# EAGLE schematic iSkipper.Ver.1.0.1 (EAGLE 9.0.0)
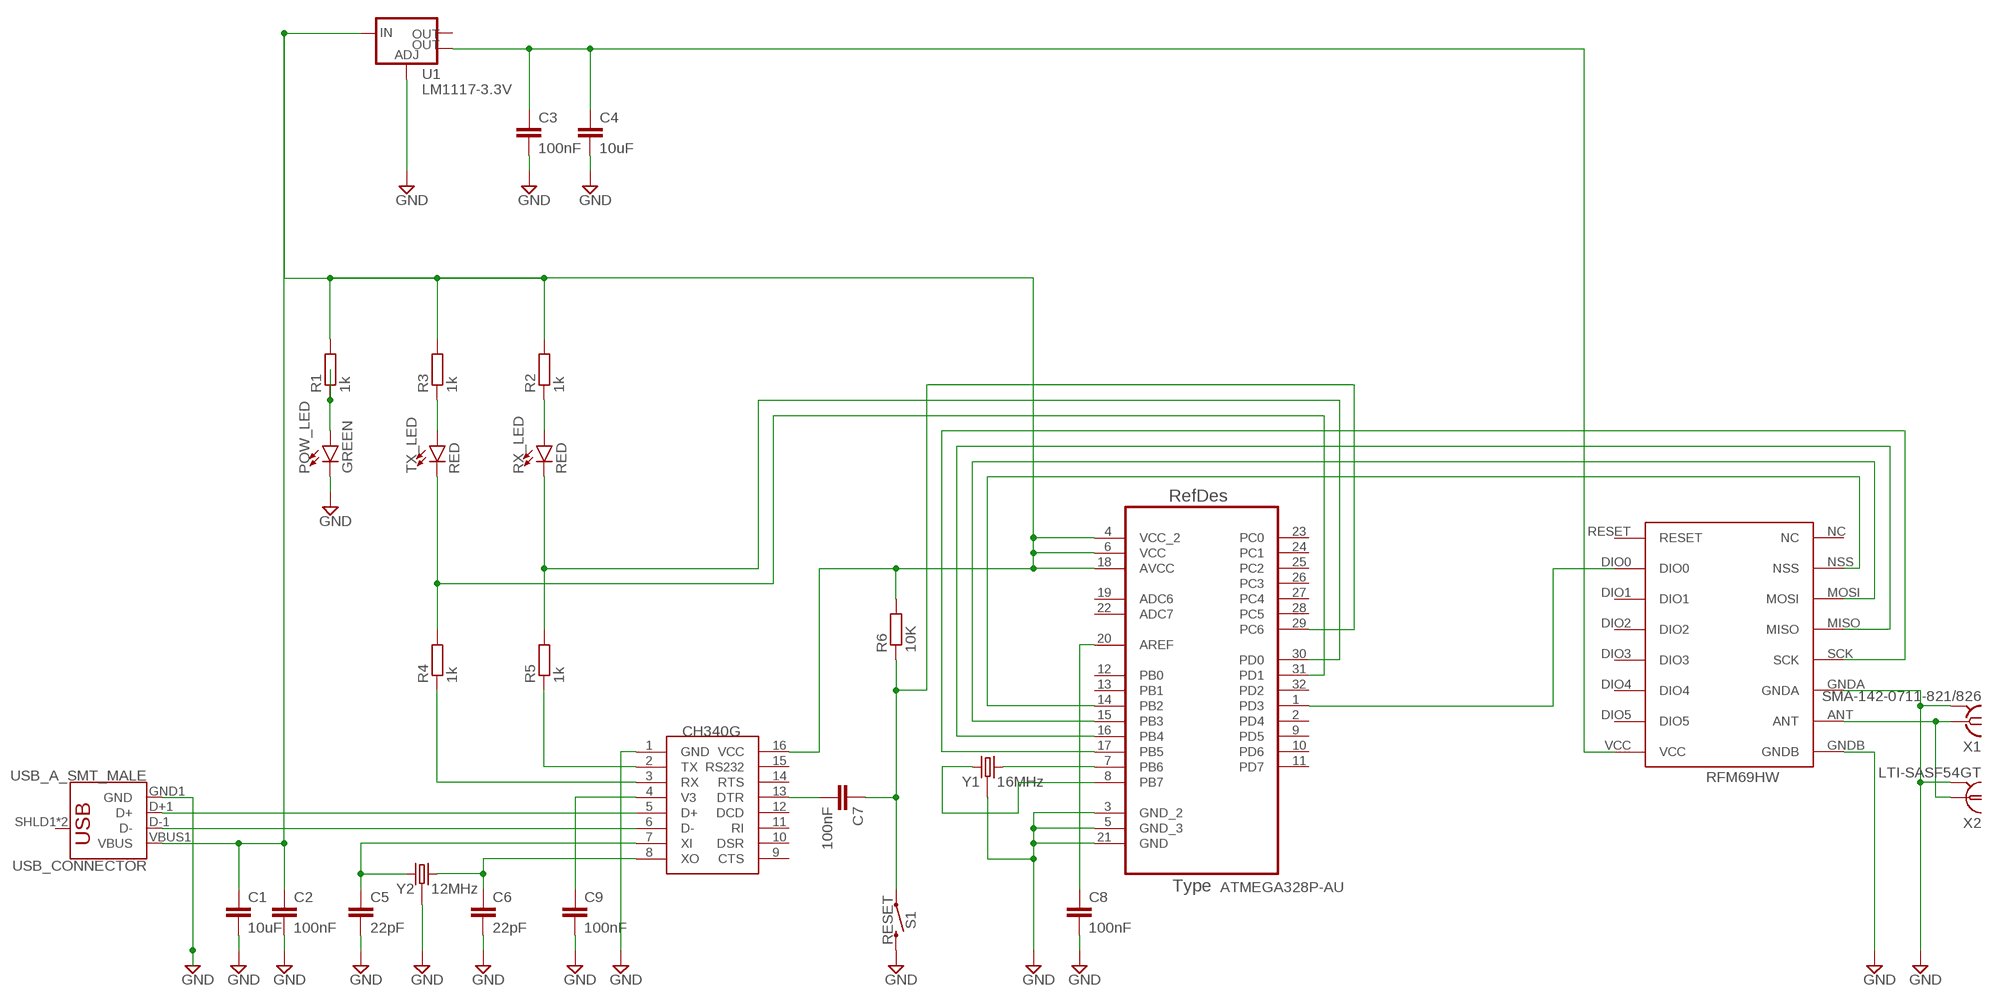
[diagram p0: schematic, sheet 1]

## Parts
ATMEGA328P  ATMEGA328P-AU  [QFP80P900X900X120-32N]
C1  10uF  CC1206  [C1206]
C2  100nF  CC1206  [C1206]
C3  100nF  C-EUC1206  [C1206]
C4  10uF  CC1206  [C1206]
C5  22pF  C-EUC1206  [C1206]
C6  22pF  C-EUC1206  [C1206]
C7  100nF  C-EUC1206  [C1206]
C8  100nF  C-EUC1206  [C1206]
C9  100nF  CC1206  [C1206]
POW_LED  GREEN  LED-GREEN1206  [LED-1206]
R1  1k  RR1206  [R1206]
R2  1k  RR1206  [R1206]
R3  1k  RR1206  [R1206]
R4  1k  RR1206  [R1206]
R5  1k  RR1206  [R1206]
R6  10K  RR1206  [R1206]
RFM69HW  RFM69HW  [RFM]
RX_LED  RED  LED-RED1206  [LED-1206]
S1  RESET  MOMENTARY-SWITCH-SPST-SMD-5.2MM  [TACTILE_SWITCH_SMD_5.2MM]
TX_LED  RED  LED-RED1206  [LED-1206]
U1  LM1117-3.3V  V_REG_LM1117SOT223  [SOT223]
U$1  CH340G  [SOIC16]
USB_CONNECTOR  USB_A_SMT_MALE  [USB-A-SMT-MALE]
X1  SMA-142-0711-821/826  [J502-ND-142-0711-821/826]
X2  LTI-SASF54GT  [LTI-SASF54GT]
Y1  16MHz  CRYSTAL-GROUNDEDSMD-3.2X2.5  [CRYSTAL-SMD-3.2X2.5MM]
Y2  12MHz  CRYSTAL-GROUNDEDSMD-3.2X2.5  [CRYSTAL-SMD-3.2X2.5MM]

## Nets
GND [Ground]: ATMEGA328P.3(GND_2) ATMEGA328P.5(GND_3) ATMEGA328P.21(GND) C1.2 C2.2 C3.2 C4.2 C5.2 C6.2 C8.2 C9.2 POW_LED.C RFM69HW.GNDA RFM69HW.GNDB S1.3 U1.1(ADJ) U$1.1(GND) USB_CONNECTOR.GND1(GND) X1.G@1 X1.G@2 X1.G@3 X1.G@4 X2.2 X2.3 X2.4 X2.5 Y1.2 Y1.4 Y2.2 Y2.4
N$1: ATMEGA328P.7(PB6) Y1.3
N$2: ATMEGA328P.8(PB7) Y1.1
N$3 [+5.0V]: ATMEGA328P.4(VCC_2) ATMEGA328P.6(VCC) ATMEGA328P.18(AVCC) C1.1 C2.1 R1.2 R2.2 R3.2 R6.2 U1.3(IN) U$1.16(VCC) USB_CONNECTOR.VBUS1(VBUS)
N$4: ATMEGA328P.20(AREF) C8.1
N$5: U$1.5(D+) USB_CONNECTOR.D+1(D+)
N$6 [+3.3V]: C3.1 C4.1 RFM69HW.VCC U1.4(OUT)
N$7: POW_LED.A R1.1
N$8: R3.1 TX_LED.A
N$9: U$1.6(D-) USB_CONNECTOR.D-1(D-)
N$10: R2.1 RX_LED.A
N$11: R5.1 U$1.2(TX)
N$12: C6.1 U$1.8(XO) Y2.3
N$13: C5.1 U$1.7(XI) Y2.1
N$14: R4.1 U$1.3(RX)
N$15: ATMEGA328P.31(PD1) R4.2 TX_LED.C
N$16: ATMEGA328P.30(PD0) R5.2 RX_LED.C
N$17: C7.2 U$1.13(DTR)
N$18: ATMEGA328P.29(PC6) C7.1 R6.1 S1.1
N$19: RFM69HW.ANT X1.1 X2.1
N$20: C9.1 U$1.4(V3)
N$22: ATMEGA328P.17(PB5) RFM69HW.SCK
N$23: ATMEGA328P.1(PD3) RFM69HW.DIO0
N$24: ATMEGA328P.14(PB2) RFM69HW.NSS
N$25: ATMEGA328P.16(PB4) RFM69HW.MISO
N$26: ATMEGA328P.15(PB3) RFM69HW.MOSI
Unconnected: ATMEGA328P.2(PD4) ATMEGA328P.9(PD5) ATMEGA328P.10(PD6) ATMEGA328P.11(PD7) ATMEGA328P.12(PB0) ATMEGA328P.13(PB1) ATMEGA328P.19(ADC6) ATMEGA328P.22(ADC7) ATMEGA328P.23(PC0) ATMEGA328P.24(PC1) ATMEGA328P.25(PC2) ATMEGA328P.26(PC3) ATMEGA328P.27(PC4) ATMEGA328P.28(PC5) ATMEGA328P.32(PD2) RFM69HW.DIO1 RFM69HW.DIO2 RFM69HW.DIO3 RFM69HW.DIO4 RFM69HW.DIO5 RFM69HW.NC RFM69HW.RESET U1.2(OUT) U$1.9(CTS) U$1.10(DSR) U$1.11(RI) U$1.12(DCD) U$1.14(RTS) U$1.15(RS232) USB_CONNECTOR.SHLD1(SHIELD) USB_CONNECTOR.SHLD2(SHIELD)

## Library data of the parts
ATMEGA328P = Atmel-ATMEGA328P-AU:ATMEGA328P-AU; DESCRIPTION: 8-bit Microcontroller with In-System Programmable Flash; MPN: ATMEGA328P-AU; OC_FARNELL: 1715486; OC_NEWARK: 14R4631; PACKAGE: TQFP-32; SUPPLIER: Atmel
C1 C2 C4 C9 = eagle-ltspice:C: CAPACITOR, European symbol; SPICEMODEL: NONE; SPICEPREFIX: C
C3 C7 = rcl:C-EU: CAPACITOR, European symbol; SPICEPREFIX: C
C5 C6 C8 = resistor:C-EU: CAPACITOR, European symbol
POW_LED = SparkFun-LED:LED-GREEN: Green SMD LED Used in manufacturing of various products at SparkFun Packages: 0603 - SMD 0603 package [Product Link] <http://www.futureelectronics.com/en/technologies/semiconductors/optoelectronics/leds/Pages/9894312-LTST-C190GKT.aspx?CrossPart=HSMG-C190&IM=0> LilyPad 1206 - SMD1206 LilyPad package [Product Link] <http://www.futureelectronics.com/en/Technologies/Product.aspx?ProductID=IN150NGHARVATEKCORPORATION2049943&IM=0> 1206 - SMD1206 package [Product Link] <http://www.futureelectronics.com/en/technologies/semiconductors/optoelectronics/leds/Pages/8315665-LTST-C150KGKT.aspx?IM=0> 1206 Bottom Mount -SMD 1206 Bottom Mount [Product Link] <http://www.digikey.com/product-detail/en/lite-on-inc/LTST-C230KGKT/160-1456-1-ND/386854> SparkFun Products: Pro Mini 328 -5V <https://www.sparkfun.com/products/821> RedBoard <https://www.sparkfun.com/products/12757> MP3 Trigger <https://www.sparkfun.com/products/13720> Makey Makey <https://www.sparkfun.com/products/11076>; PROD_ID: DIO-00862
R1-R6 = eagle-ltspice:R: RESISTOR, European symbol; SPICEMODEL: NONE; SPICEPREFIX: R
RFM69HW = hoperf:RFM69HW; TYPE: RFM69HW
RX_LED TX_LED = SparkFun-LED:LED-RED: Red SMD LED Used in manufacturing of most products at SparkFun Packages: 0603 - SMD 0603 package [Product Link] <http://docs.avagotech.com/docs/AV02-0551EN> 0603 SMART - SMD 0603 SMART package ( more efficient and expensive)[Product Link] <http://www.osram-os.com/Graphics/XPic2/00077099_0.pdf> 1206 - SMD1206 package [Product Link] <https://www.sparkfun.com/datasheets/DevTools/LilyPad/Q150OVS4.pdff> SparkFun Products: Pro Mini 328 -5V <https://www.sparkfun.com/products/821> RedBoard <https://www.sparkfun.com/products/12757> IOIO-OTG <https://www.sparkfun.com/products/13613>; PROD_ID: DIO-09912
S1 = SparkFun-Switches:MOMENTARY-SWITCH-SPST: Momentary Switch (Pushbutton) - SPST Normally-open (NO) SPST momentary switches (buttons, pushbuttons). Variants PTH-12MM - 12mm square, through-hole Momentary Pushbutton Switch - 12mm Square <https://www.sparkfun.com/products/9190> (COM-09190) PTH-6.0MM, PTH-6.0MM-KIT - 6.0mm square, through-hole Mini Pushbutton Switch <https://www.sparkfun.com/products/97> (COM-00097) KIT package intended for soldering kit's - only one side of pads' copper is exposed. PTH-RIGHT-ANGLE-KIT - Right-angle, through-hole Right Angle Tactile Button <https://www.sparkfun.com/products/10791> - Used on SparkFun BigTime Watch Kit <https://www.sparkfun.com/products/11734> SMD-12MM - 12mm square, surface-mount Tactile Button - SMD (12mm) <https://www.sparkfun.com/products/12993> (COM-12993) Used on SparkFun PicoBoard <https://www.sparkfun.com/products/11888> SMD-4.5MM - 4.5mm Square Trackball Switch Used on SparkFun Blackberry Trackballer Breakout <https://www.sparkfun.com/products/13169> SMD-4.6MMX2.8MM - 4.60mm x 2.80mm, surface mount Used on SparkFun SAMD21 Mini Breakout <https://www.sparkfun.com/products/13664> SMD-5.2MM, SMD-5.2-REDUNDANT - 5.2mm square, surface-mount Mini Pushbutton Switch - SMD <https://www.sparkfun.com/products/8720> (COM-08720) Used on Arduino Pro Mini <https://www.sparkfun.com/products/11114> REDUNDANT package connects both switch circuits together SMD-6.0X3.5MM - 6.0 x 3.5mm, surface mount Momentary Reset Switch SMD <https://www.sparkfun.com/products/8229> (COM-08229) SMD-6.2MM-TALL - 6.2mm square, surface mount Tactile Button - SMD (6mm) <https://www.sparkfun.com/products/12992> Used on SparkFun Digital Sandbox <https://www.sparkfun.com/products/12651> SMD-RIGHT-ANGLE - Right-angle, surface mount Used on SparkFun Block for Intel® Edison - Arduino <https://www.sparkfun.com/products/13036>; PROD_ID: SWCH-08247; SF_SKU: COM-08720
U1 = SparkFun-IC-Power:V_REG_LM1117: Voltage Regulator LM1117 Standard adjustable voltage regulator but in SMD form. Spark Fun Electronics SKU : COM-00595; PROD_ID: VREG-08170
U$1 = ch340g:CH340G
USB_CONNECTOR = SparkFun-Connectors:USB_A: USB-A Connector Male and female variants, as well as PTH and SMT variants SparkFun Products: SparkFun XBee Explorer Dongle <https://www.sparkfun.com/products/11697> PTH Male SparkFun MicroView-USB Programmer <https://www.sparkfun.com/products/12924> SMT Male SparkFun USB Type A Female Breakout <https://www.sparkfun.com/products/12700> SMT Female; PROD_ID: CONN-11499
X1 = con-coax:SMA-: SMA 50 Ohm End Launch Jack Receptacle - Round Contact Johnson Components Source: www.johnsoncomponents.com .. J502-ND.pdf; MF: JOHNSON COMPONENTS; MPN: 142-0711-821; OC_FARNELL: 1019328; OC_NEWARK: 16F3627
X2 = con-coax:LTI-SASF54GT: SMA vertical PCB thrue hole jack Source: Lighthorse Technologies, inc. SASF54GT.pdf; OC_FARNELL: unknown; OC_NEWARK: unknown
Y1 Y2 = SparkFun-Clocks:CRYSTAL-GROUNDED: Crystals w/ Ground Pin (Generic) These are passive quartz crystals, which can be used as a clock source for a microcontroller. Crystal's are usually two-terminal devices. A third terminal may be optionally connected to ground, as recommended by the manufaturer.